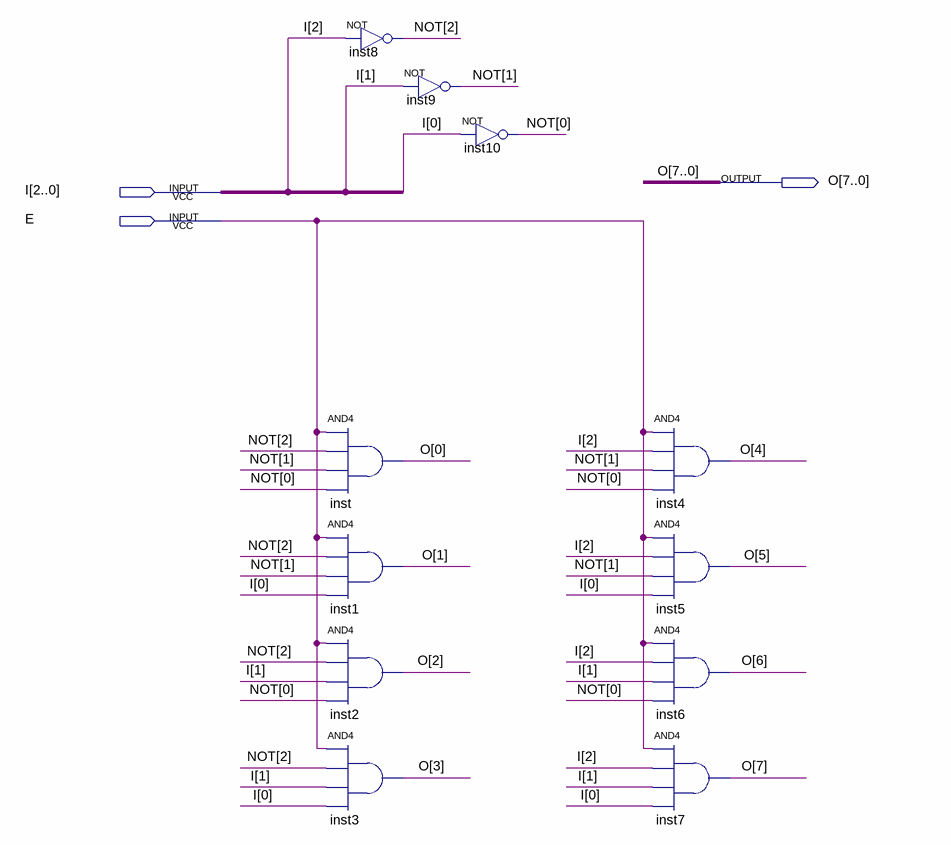
[diagram p0: schematic sheet]
// Quartus schematic Dec3-8.bdf as structural Verilog: 11 symbols, 3 pins
module \Dec3-8  (
  input  [2:0] I,
  input  E,
  output [7:0] O
);

  wire [2:0] NOT;

  not inst8 (NOT[2], I[2]);
  and inst (O[0], E, NOT[2], NOT[1], NOT[0]);
  and inst1 (O[1], E, NOT[2], NOT[1], I[0]);
  and inst2 (O[2], E, NOT[2], I[1], NOT[0]);
  and inst3 (O[3], E, NOT[2], I[1], I[0]);
  not inst9 (NOT[1], I[1]);
  not inst10 (NOT[0], I[0]);
  and inst4 (O[4], E, I[2], NOT[1], NOT[0]);
  and inst5 (O[5], E, I[2], NOT[1], I[0]);
  and inst6 (O[6], E, I[2], I[1], NOT[0]);
  and inst7 (O[7], E, I[2], I[1], I[0]);
endmodule
